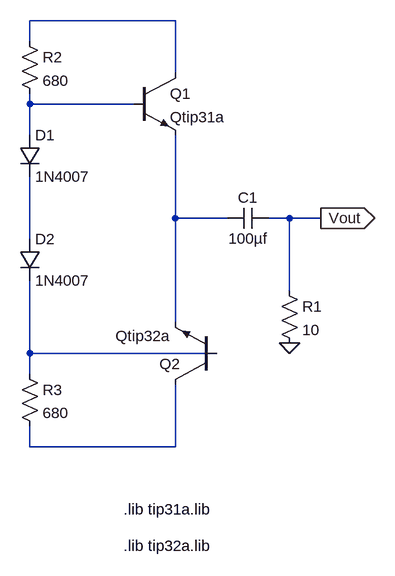
[diagram p0: schematic power_amplifier.asc]
power_amplifier.asc, the LTspice schematic file:
Version 4
SHEET 1 880 680
WIRE 336 -176 112 -176
WIRE 112 -144 112 -176
WIRE 336 -96 336 -176
WIRE 112 -48 112 -64
WIRE 272 -48 112 -48
WIRE 112 0 112 -48
WIRE 112 160 112 64
WIRE 336 128 336 0
WIRE 416 128 336 128
WIRE 512 128 480 128
WIRE 560 128 512 128
WIRE 512 240 512 128
WIRE 336 288 336 128
WIRE 112 336 112 224
WIRE 400 336 112 336
WIRE 112 368 112 336
WIRE 112 480 112 448
WIRE 336 480 336 384
WIRE 336 480 112 480
FLAG 512 320 0
FLAG 560 128 Vout
IOPIN 560 128 Out
SYMBOL diode 96 0 R0
SYMATTR InstName D1
SYMATTR Value 1N4007
SYMBOL diode 96 160 R0
SYMATTR InstName D2
SYMATTR Value 1N4007
SYMBOL npn 272 -96 R0
SYMATTR InstName Q1
SYMATTR Value Qtip31a
SYMBOL npn 400 384 R180
WINDOW 3 71 75 Left 2
SYMATTR Value Qtip32a
SYMATTR InstName Q2
SYMBOL cap 480 112 R90
WINDOW 0 0 32 VBottom 2
WINDOW 3 32 32 VTop 2
SYMATTR InstName C1
SYMATTR Value 100µf
SYMBOL res 496 224 R0
SYMATTR InstName R1
SYMATTR Value 10
SYMBOL res 96 -160 R0
SYMATTR InstName R2
SYMATTR Value 680
SYMBOL res 96 352 R0
SYMATTR InstName R3
SYMATTR Value 680
TEXT 256 576 Left 2 !.lib tip31a.lib
TEXT 256 632 Left 2 !.lib tip32a.lib

The netlist it stands for:
* power_amplifier.asc
D1 N002 N003 1N4007
D2 N003 N005 1N4007
Q1 N001 N002 N004 0 Qtip31a
Q2 N006 N005 N004 0 Qtip32a
C1 Vout N004 100µf
R1 Vout 0 10
R2 N001 N002 680
R3 N005 N006 680
.model D D
.lib standard.dio
.model NPN NPN
.model PNP PNP
.lib standard.bjt
.lib tip31a.lib
.lib tip32a.lib
.backanno
.end